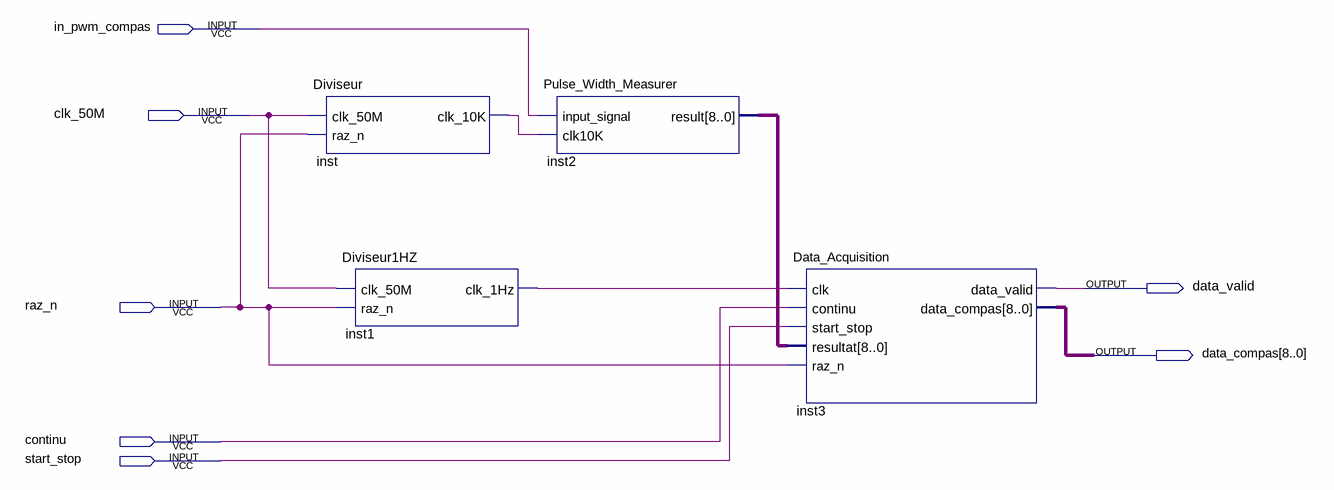
[diagram p0: schematic sheet]
// Quartus schematic gestion_compas.bdf as structural Verilog: 4 symbols, 7 pins
module gestion_compas (
  input  in_pwm_compas,
  input  clk_50M,
  input  raz_n,
  input  continu,
  input  start_stop,
  output data_valid,
  output [8:0] data_compas
);

  wire inst1_clk_1hz, inst_clk_10k;
  wire [8:0] inst2_result;

  Diviseur inst (.clk_50M(clk_50M), .raz_n(raz_n), .clk_10K(inst_clk_10k));
  Diviseur1HZ inst1 (.clk_50M(clk_50M), .raz_n(raz_n), .clk_1Hz(inst1_clk_1hz));
  Pulse_Width_Measurer inst2 (.input_signal(in_pwm_compas), .clk10K(inst_clk_10k), .result(inst2_result));
  Data_Acquisition inst3 (
    .clk(inst1_clk_1hz), .continu(continu), .start_stop(start_stop), .resultat(inst2_result), .raz_n(raz_n),
    .data_valid(data_valid), .data_compas(data_compas));
endmodule
